# Altium schematic sheet 02_MCU_IO.SchDoc
size 420 x 297 mm; PageSetup: Record=PageOptions|CenterHorizontal=True|CenterVertical=True|PrintScale=0.94|XCorrection=1.00|YCorrection=1.00|PrintKind=1|BorderSize=5000000|LeftOffset=0|BottomOffset=0|Orientation=1|PaperLength=1000|PaperWidth=1000|Scale=100|PaperSource=7|PrintQuality=-4|MediaType=1|DitherType=10|PaperKind=A4|PrintScaleMode=1; DecimalNumber: Децимальный номер; HeadOfSector: Нач. сектора; MainDevice: Перв.примен.; Name: Наименование; Наименование2: PicoLimitSwitchShield — MCU & IO; Author: ALTIUM GOSTBOM2.0 KEV; SheetNumber: 2; SheetTotal: 2; Sheet_No: 2; Sheet_all: 2
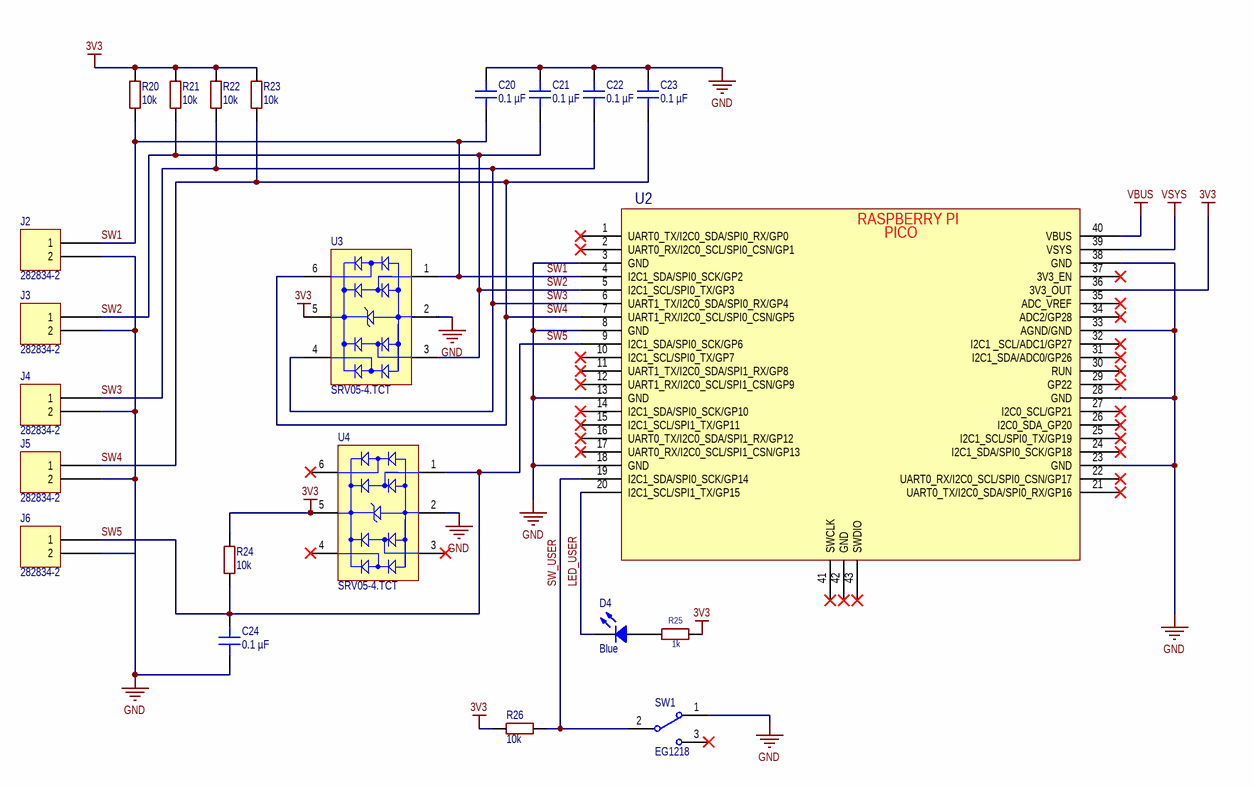
[diagram p0: 02_MCU_IO.SchDoc]

## Parts
C20  0.1 µF  [CAP 0603_1608]
C21  0.1 µF  [CAP 0603_1608]
C22  0.1 µF  [CAP 0603_1608]
C23  0.1 µF  [CAP 0603_1608]
C24  0.1 µF  [CAP 0603_1608]
D4  Blue  [LED 0603_1608 BLUE]
J2  282834-2  [TE 282834-2]
J3  282834-2  [TE 282834-2]
J4  282834-2  [TE 282834-2]
J5  282834-2  [TE 282834-2]
J6  282834-2  [TE 282834-2]
R20  10k  [RESC1608(0603)N]
R21  10k  [RESC1608(0603)N]
R22  10k  [RESC1608(0603)N]
R23  10k  [RESC1608(0603)N]
R24  10k  [RESC1608(0603)N]
R25  1k  [RESC1608(0603)N]
R26  10k  [RESC1608(0603)N]
SW1  EG1218  [ESWI-EG1218_V]
U2  RPI_PICO  [RPI PICO 2020]  (value not drawn)
U3  SRV05-4.TCT  [SMTC-SOT23-6_V]
U4  SRV05-4.TCT  [SMTC-SOT23-6_V]

## Nets
3V3: R20.2 R21.2 R22.2 R23.2 R24.2 R25.1 R26.2 U2.36(3V3_OUT) U3.5(VBUS) U4.5(VBUS)
GND: C20.2 C21.2 C22.2 C23.2 C24.1 J2.2 J3.2 J4.2 J5.2 J6.2 SW1.1 U2.3(GND) U2.8(GND) U2.13(GND) U2.18(GND) U2.23(GND) U2.28(GND) U2.33(AGND/GND) U2.38(GND) U3.2(GND) U4.2(GND)
VBUS: U2.40(VBUS)
VSYS: U2.39(VSYS)
LED_USER: D4.2 U2.20(I2C1_SCL/SPI1_TX/GP15)
SW1: C20.1 J2.1 R20.1 U2.4(I2C1_SDA/SPI0_SCK/GP2) U3.1(I/O_1)
SW2: C21.1 J3.1 R21.1 U2.5(I2C1_SCL/SPI0_TX/GP3) U3.3(I/O_2)
SW3: C22.1 J4.1 R22.1 U2.6(UART1_TX/I2C0_SDA/SPI0_RX/GP4) U3.4(I/O_3)
SW4: C23.1 J5.1 R23.1 U2.7(UART1_RX/I2C0_SCL/SPI0_CSN/GP5) U3.6(I/O_4)
SW5: C24.2 J6.1 R24.1 U2.9(I2C1_SDA/SPI0_SCK/GP6) U4.1(I/O_1)
SW_USER: R26.1 SW1.2(COM) U2.19(I2C1_SDA/SPI0_SCK/GP14)
NetD4_1: D4.1 R25.2

Not connected (* = marked no-connect by the designer): SW1 3*; U2 1(UART0_TX/I2C0_SDA/SPI0_RX/GP0)* 2(UART0_RX/I2C0_SCL/SPI0_CSN/GP1)* 10(I2C1_SCL/SPI0_TX/GP7)* 11(UART1_TX/I2C0_SDA/SPI1_RX/GP8)* 12(UART1_RX/I2C0_SCL/SPI1_CSN/GP9)* 14(I2C1_SDA/SPI0_SCK/GP10)* 15(I2C1_SCL/SPI1_TX/GP11)* 16(UART0_TX/I2C0_SDA/SPI1_RX/GP12)* 17(UART0_RX/I2C0_SCL/SPI1_CSN/GP13)* 21(UART0_TX/I2C0_SDA/SPI0_RX/GP16)* 22(UART0_RX/I2C0_SCL/SPI0_CSN/GP17)* 24(I2C1_SDA/SPI0_SCK/GP18)* 25(I2C1_SCL/SPI0_TX/GP19)* 26(I2C0_SDA_GP20)* 27(I2C0_SCL/GP21)* 29(GP22)* 30(RUN)* 31(I2C1_SDA/ADC0/GP26)* 32(I2C1__SCL/ADC1/GP27)* 34(ADC2/GP28)* 35(ADC_VREF)* 37(3V3_EN)* 41(SWCLK)* 42(GND)* 43(SWDIO)*; U4 3(I/O_2)* 4(I/O_3)* 6(I/O_4)*

## Notes on the sheet
- Перв. примен.
- Справ. №
- Подп. дата
- Инв. № дубл.
- Взам. инв. №
- Подп. и дата
- Изм.
- Разраб.
- Лист
- № докум.
- Подп.
- Дата
- Лит.
- Масса
- Масштаб
- Пров.
- Т.контр.
- Листов
- Инв. № подл.
- Н.контр.
- Утв.
- ALTIUM GOSTBOM2.0 KEV
- Файл:
- Копировал
- Формат А3
- (in symbol RPI_PICO) RASPBERRY PI; PICO

## Library data of the parts
C20-C24 = 100X14W104MV4T: CAP CER 0.1UF 10V X7R 0603; manufacturer: Johanson Dielectrics Inc.; Tolerance: ±20%; Part Number: 100X14W104MV4T; Capacitance: 0.1 µF; Applications: Bypass, Decoupling; componentlink1description: Datasheet; componentlink1url: https://www.johansondielectrics.com/downloads/x2y-filter-and-decoupling-capacitors.pdf; componentlink2description: DigiKey Link; componentlink2url: https://www.digikey.com/en/products/detail/johanson-dielectrics-inc/100X14W104MV4T/1655914; Device Package: 0603 (1608 Metric); Features: Low ESL (X2Y); lastupdated: 06.04.2026 19:23:51; Lifecycle Status: Active; Minimum Order: 1; Mounting Type: Surface Mount, MLCC; Operating Temperature: -55°C ~ 125°C; Package / Case: 0603 (1608 Metric); packaging: TapeAndReel; partid: 2680; Part Status: Active; price: 0.08; series: X2Y®; Size / Dimension: 0.064" L x 0.035" W (1.63mm x 0.89mm); Supplier 1: DigiKey; Supplier Part Number 1: 709-1101-1-ND; Temperature Coefficient: X7R; Thickness (Max): 0.026" (0.66mm); value: 0.1 µF; Voltage - Rated: 10V
D4 = QBLP601-IB: LED BLUE CLEAR 0603 SMD; Manufacturer: QT Brightek (QTB); Configuration: Standard; Current - Test: 20mA; Lens Color: Colorless; Lens Size: 1.10mm x 0.80mm; Lens Style: Rectangle with Flat Top; Millicandela Rating: 100mcd; Viewing Angle: 140°; Voltage - Forward (Vf) (Typ): 3.2V; Wavelength - Dominant: 470nm; Wavelength - Peak: 468nm; Part Number: QBLP601-IB; Color: Blue; ComponentLink1Description: Datasheet; ComponentLink1URL: http://www.qt-brightek.com/datasheet/QBLP601_series.pdf; ComponentLink2Description: DigiKey Link; ComponentLink2URL: https://www.digikey.com/en/products/detail/qt-brightek-qtb/QBLP601-IB/4814652; Device Package: 0603 (1608 Metric); Height (Max): 0.60mm; LastUpdated: 05.04.2026 20:35:04; Lens Transparency: Clear; Lifecycle Status: Active; Minimum Order: 1; Mounting Type: Surface Mount; Package / Case: 0603 (1608 Metric); Packaging: TapeAndReel; PartId: 784; Part Status: Active; Price: 0.06; Series: QBLP601; Size / Dimension: 1.60mm L x 0.80mm W; Supplier 1: DigiKey; Supplier Part Number 1: 1516-1054-1-ND; Supplier Device Package: 0603; Value: Blue
J2-J6 = 282834-2: TERM BLK 2P SIDE ENT 2.54MM PCB; Manufacturer: TE Connectivity AMP Connectors; Current: 10A; Mating Orientation: Horizontal with Board; Number of Levels: 1; Pitch: 0.100" (2.54mm); Positions Per Level: 2; Voltage: 150V; Wire Gauge: 16-30 AWG; Wire Termination: Screw - Rising Cage Clamp; Part Number: 282834-2; Color: Green; ComponentLink1Description: Datasheet; ComponentLink1URL: https://www.te.com/commerce/DocumentDelivery/DDEController?Action=srchrtrv&DocNm=282834&DocType=Customer+Drawing&DocLang=English; ComponentLink2Description: DigiKey Link; ComponentLink2URL: http://digikey.com/product-detail/en/te-connectivity-amp-connectors/282834-2/A98333-ND/1150135; LastUpdated: 15.01.2020 4:15:38; Lifecycle Status: Active; Minimum Order: 1; Mounting Type: Through Hole; Packaging: Bulk; Part Status: Active; Price: 0.88; Series: Buchanan; Supplier 1: DigiKey; Supplier Part Number 1: A98333-ND
R20-R24 R26 = RC0603FR-0710KL: RES SMD 0603 10k 1% 100ppm; Note: Backorder; Part Number: RC0603FR-0710KL; HelpURL: https://eu.mouser.com/ProductDetail/Yageo/RC0603FR-0710KL?qs=grNVn54RoB%252B3GtjbJj3wJQ%3D%3D; Manufacturer Part Number: RC0603FR-0710KL; Package: 0603; Mouser Part Number: 603-RC0603FR-0710KL
R25 = RT0603DRE071KL: RES SMD 0603 1.00k 0.5% 50ppm; Part Number: RT0603DRE071KL; HelpURL: https://eu.mouser.com/ProductDetail/Yageo/RT0603DRE071KL?qs=sGAEpiMZZMvdGkrng054t1nmr2c61WvafBArSy4TrV4%3D; Manufacturer Part Number: RT0603DRE071KL; Package: 0603; Mouser Part Number: 603-RT0603DRE071KL
SW1 = CMP-1696-00002-1: Slide Switch, 500 V, -20 to 70 degC, 3-Pin THD, RoHS; Case\Package: SOT-23-5; Output Current: 150 mA; Nominal Output Voltage: 3.3 V; Max Power Dissipation: 250 mW; Min Input Voltage: 4.3 V; Outputs: 1; Max Input Voltage: 8 V; Dropout Voltage: 300 mV; PackageDescription: 3-Pin Through Hole Device, Body 11.6 x 4 mm, Pitch 2.5 mm; ComponentLink1URL: http://www.e-switch.ch/en/; RoHSCompliant: true; Length: 3 mm; ComponentLink1Description: Manufacturer URL; Power Rating: 250 mW; Mount: Surface Mount; Max Operating Temperature: 85 degC; REACH SVHC: No SVHC; Radiation Hardening: No; Height: 1.3 mm; Pins: 5; Max Ouput Current: 150 mA; Output Voltage: 3.3 V; Width: 1.8 mm; Package Quantity: 3000; ComponentLink2URL: https://www.e-switch.com/system/asset/product_line/data_sheet/119/EG.pdf; Min Operating Temperature: -40 degC; ComponentLink2Description: Datasheet; DatasheetVersion: Oct-15; PackageReference: EG1218; Packaging: Tape and Reel
U3 U4 = CMP-2000-05358-1: RailClamp(R) Low Capacitance TVS Diode Array, 5 pF, 17.5 VC, -55 to 125 degC, 6-Pin SOT23, RoHS, Tape and Reel; Manufacturer: Semtech; Leakage Current (Max): 5uA; Polarity: Uni-Directional; Peak Pulse Power Dissipation: 300W; Clamping Voltage: 17.5V; Number of Elements: 1; Working Voltage: 5V; Test Current (It): 1mA; Configuration: Quad; Reverse Breakdown Voltage: 6V; Suppressor Type: DiodeArrays; Peak Pulse Current: 12A; Product Depth (mm): 1.6mm; Product Height (mm): 1.15mm; Clamping Voltage (Max): 12.5V; Rad Hardened: No; Product Length (mm): 2.9mm; Capacitance Value: 5pF; Mounting: SurfaceMount; Datasheet URL: https://datasheet.ciiva.com/8029/srv05-4-8029973.pdf; Datasheet Version: Jan-08; Packaging: TapeandReel; Package / Case: SOT-23; Operating Temp Range: -55Cto125C; Pin Count: 6; Direction Type: Uni-Directional; Operating Temperature Min Deg. C: -55C; Reverse Stand-off Voltage: 5V; Leakage Current: 5uA; Manufacturer URL: http://www.semtech.com/; Working Voltage (Max): 5V; Package Reference: SOT23-6; Package Description: 6-Pin Small Outline Transistor, Body 2.9 x 1.6 mm, Pitch 0.95 mm; Operating Temperature Max Deg. C: 125C; Operating Temperature Classification: Military; Mounting Style: SurfaceMount